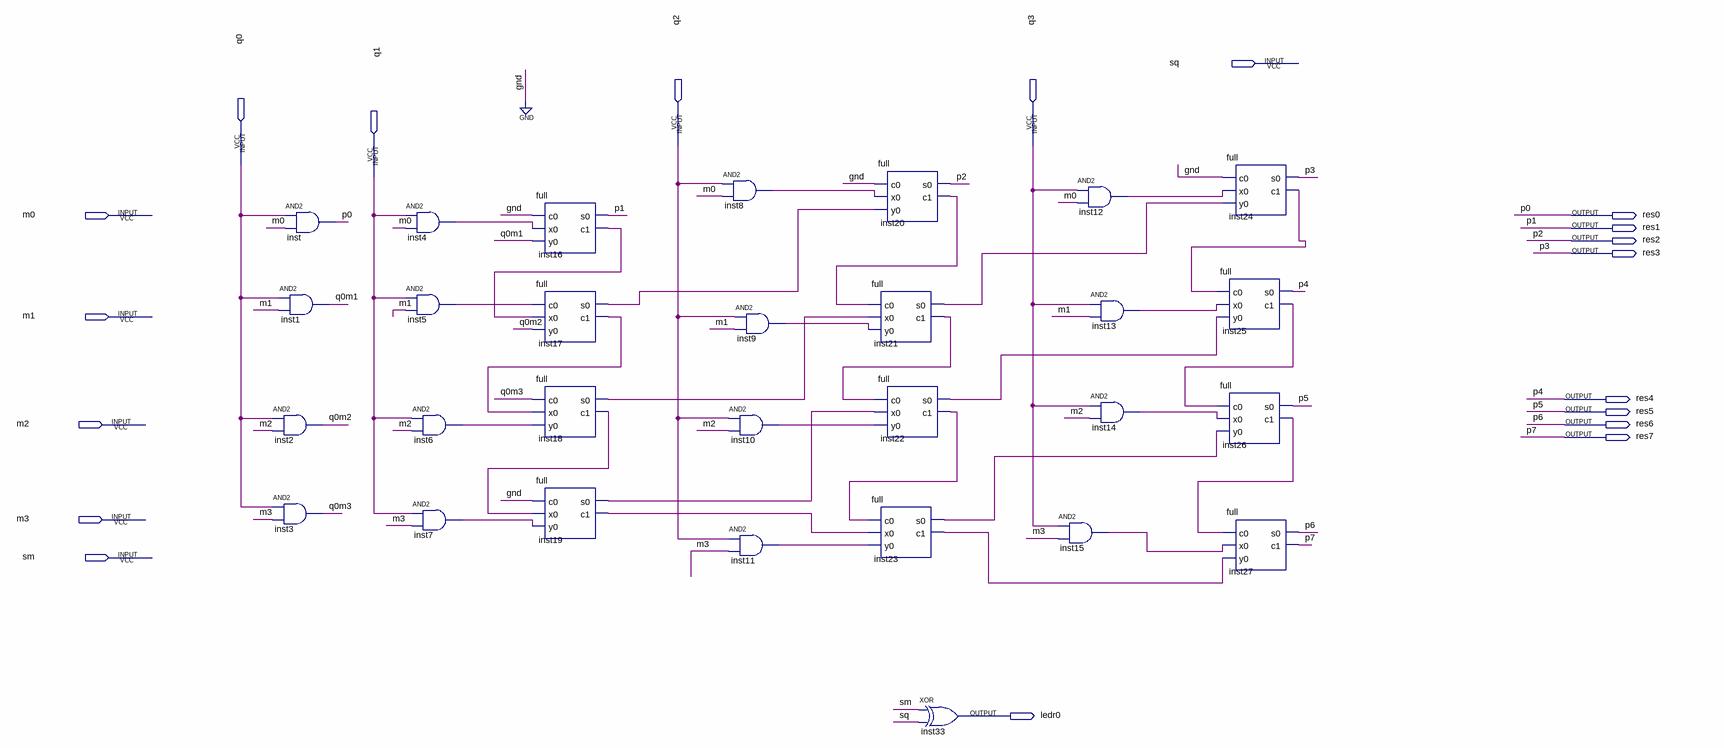
[diagram p0: schematic sheet]
// Quartus schematic mutiplicador.bdf as structural Verilog: 29 symbols, 19 pins
module mutiplicador (
  input  sq,
  input  q2,
  input  q3,
  input  q0,
  input  q1,
  input  m0,
  input  m1,
  input  m2,
  input  m3,
  input  sm,
  output res0,
  output res1,
  output res2,
  output res3,
  output res4,
  output res5,
  output res6,
  output res7,
  output ledr0
);

  wire inst4_out, inst5_out, inst6_out, inst7_out, inst8_out, inst9_out, inst10_out, inst11_out, inst12_out,
       inst13_out, inst14_out, inst15_out, inst16_c1, inst17_c1, inst17_s0, inst18_c1, inst18_s0, inst19_c1,
       inst19_s0, inst20_c1, inst21_c1, inst21_s0, inst22_c1, inst22_s0, inst23_c1, inst23_s0, inst24_c1,
       inst25_c1, inst26_c1, q0m1, q0m2, q0m3;

  and inst (res0, q0, m0);
  and inst1 (q0m1, q0, m1);
  and inst2 (q0m2, q0, m2);
  and inst3 (q0m3, q0, m3);
  and inst4 (inst4_out, q1, m0);
  and inst5 (inst5_out, q1, m1);
  and inst6 (inst6_out, q1, m2);
  and inst7 (inst7_out, q1, m3);
  full inst16 (.c0(1'b0), .x0(inst4_out), .y0(q0m1), .s0(res1), .c1(inst16_c1));
  full inst17 (.c0(inst5_out), .x0(inst16_c1), .y0(q0m2), .s0(inst17_s0), .c1(inst17_c1));
  full inst18 (.c0(q0m3), .x0(inst17_c1), .y0(inst6_out), .s0(inst18_s0), .c1(inst18_c1));
  full inst19 (.c0(1'b0), .x0(inst18_c1), .y0(inst7_out), .s0(inst19_s0), .c1(inst19_c1));
  and inst8 (inst8_out, q2, m0);
  and inst9 (inst9_out, q2, m1);
  and inst10 (inst10_out, q2, m2);
  and inst11 (inst11_out, q2, m3);
  full inst20 (.c0(1'b0), .x0(inst8_out), .y0(inst17_s0), .s0(res2), .c1(inst20_c1));
  full inst21 (.c0(inst20_c1), .x0(inst18_s0), .y0(inst9_out), .s0(inst21_s0), .c1(inst21_c1));
  full inst22 (.c0(inst21_c1), .x0(inst19_s0), .y0(inst10_out), .s0(inst22_s0), .c1(inst22_c1));
  full inst23 (.c0(inst22_c1), .x0(inst19_c1), .y0(inst11_out), .s0(inst23_s0), .c1(inst23_c1));
  xor inst33 (ledr0, sm, sq);
  and inst12 (inst12_out, q3, m0);
  and inst13 (inst13_out, q3, m1);
  and inst14 (inst14_out, q3, m2);
  and inst15 (inst15_out, q3, m3);
  full inst24 (.c0(1'b0), .x0(inst12_out), .y0(inst21_s0), .s0(res3), .c1(inst24_c1));
  full inst25 (.c0(inst24_c1), .x0(inst13_out), .y0(inst22_s0), .s0(res4), .c1(inst25_c1));
  full inst26 (.c0(inst25_c1), .x0(inst14_out), .y0(inst23_s0), .s0(res5), .c1(inst26_c1));
  full inst27 (.c0(inst26_c1), .x0(inst15_out), .y0(inst23_c1), .s0(res6), .c1(res7));

  // Other names for the same wires on the sheet: p0 = res0; p1 = res1; p2 = res2; p3 = res3; p4 = res4; p5 = res5;
  //   p6 = res6; p7 = res7
endmodule
